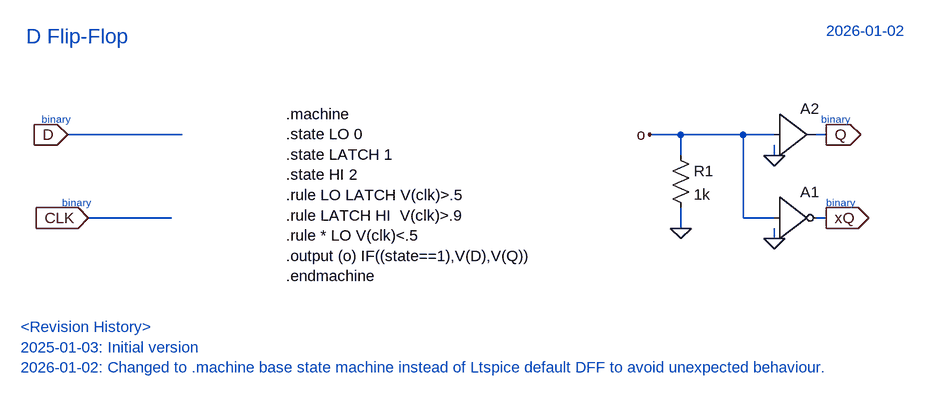
[diagram p0: schematic DFF.asc]
DFF.asc, the LTspice schematic file:
Version 4.1
SHEET 1 1208 680
WIRE -16 -496 -192 -496
WIRE 752 -496 704 -496
WIRE 848 -496 752 -496
WIRE 896 -496 848 -496
WIRE 976 -496 960 -496
WIRE 752 -464 752 -496
WIRE 896 -464 896 -480
WIRE -32 -368 -160 -368
WIRE 848 -368 848 -496
WIRE 896 -368 848 -368
WIRE 976 -368 960 -368
WIRE 752 -352 752 -384
WIRE 896 -336 896 -352
FLAG -192 -496 D
IOPIN -192 -496 In
FLAG -160 -368 CLK
IOPIN -160 -368 In
FLAG 976 -496 Q
IOPIN 976 -496 Out
FLAG 976 -368 xQ
IOPIN 976 -368 Out
FLAG 896 -336 0
FLAG 896 -464 0
FLAG 752 -352 0
FLAG 704 -496 o
SYMBOL Digital\\inv 896 -432 R0
SYMATTR InstName A1
SYMBOL Digital\\buf1 896 -560 R0
SYMATTR InstName A2
SYMBOL res 736 -480 R0
SYMATTR InstName R1
SYMATTR Value 1k
TEXT -256 -648 Left 3 ;D Flip-Flop
TEXT -232 -520 Left 1 ;binary
TEXT -200 -392 Left 1 ;binary
TEXT 968 -520 Left 1 ;binary
TEXT 976 -392 Left 1 ;binary
TEXT 976 -656 Left 2 ;2026-01-02
TEXT 144 -528 Left 2 !.machine\n.state LO 0\n.state LATCH 1\n.state HI 2\n.rule LO LATCH V(clk)>.5\n.rule LATCH HI  V(clk)>.9\n.rule * LO V(clk)<.5\n.output (o) IF((state==1),V(D),V(Q))  \n.endmachine
TEXT -264 -200 Left 2 ;<Revision History>\n2025-01-03: Initial version\n2026-01-02: Changed to .machine base state machine instead of Ltspice default DFF to avoid unexpected behaviour.

The netlist it stands for:
* DFF.asc
A1 o 0 0 0 0 xQ 0 0 BUF
A2 o 0 0 0 0 0 Q 0 BUF
R1 o 0 1k
* D Flip-Flop
* binary
* binary
* binary
* binary
* 2026-01-02
.machine
.state LO 0
.state LATCH 1
.state HI 2
.rule LO LATCH V(clk)>.5
.rule LATCH HI  V(clk)>.9
.rule * LO V(clk)<.5
.output (o) IF((state==1),V(D),V(Q))
.endmachine
* <Revision History>
* 2025-01-03: Initial version
* 2026-01-02: Changed to .machine base state machine instead of Ltspice default DFF to avoid unexpected behaviour.
.backanno
.end